# Altium project BRZ_LightLink.PrjPcb
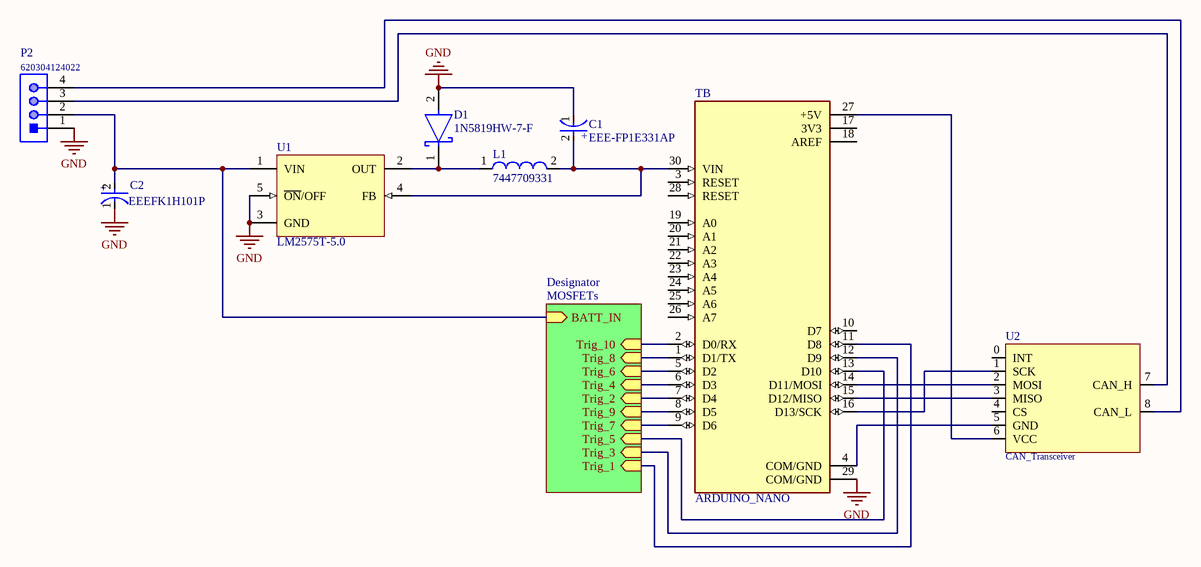
[diagram p0: LightLink.SchDoc]
2 sheets, 29 parts. Net scope: hierarchical (ports join the sheet entries above them; power ports are global).
Board file: LightLink.PcbDoc
Sheets:
  LightLink.SchDoc
    Designator = MOSFETs.SchDoc

## Sheet LightLink.SchDoc
size A4; SheetNumber: 1; SheetTotal: 3

### Parts
C1  EEE-FP1E331AP  [FP-FPF-MFG]
C2  EEEFK1H101P  [FP-FKF-MFG]
D1  1N5819HW-7-F  [FP-SOD123-IPC_A]
L1  7447709331  [WE-PD-XXL]
P2  620304124022  [620304124022]
TB  ARDUINO_NANO  [SHIELD_ARDUINO_NANO]
U1  LM2575T-5.0  [KC0005A]
U2  CAN_Transceiver

### Sub-sheets
Designator = MOSFETs: Trig_1 (in), Trig_3 (in), Trig_5 (in), Trig_7 (in), Trig_9 (in), Trig_2 (in), Trig_4 (in), Trig_6 (in), Trig_8 (in), Trig_10 (in), BATT_IN (in)

### Nets
GND: C1.1(C) C2.1(C) D1.2(A) P2.1 TB.29(COM/GND) U1.3(GND) U1.5(~{ON}/OFF)
NetC1_2: C1.2(A) L1.2 TB.30(VIN) U1.4(FB)
NetC2_2: C2.2(A) P2.2 U1.1(VIN) ; sheet Designator/BATT_IN
NetD1_1: D1.1(C) L1.1 U1.2(OUT)
NetP2_3: P2.3 U2.7(CAN_H)
NetP2_4: P2.4 U2.8(CAN_L)
NetR1_1: TB.11(D8) ; sheet Designator/Trig_1
NetR2_1: TB.12(D9) ; sheet Designator/Trig_3
NetR3_2: TB.7(D4) ; sheet Designator/Trig_2
NetR4_1: TB.13(D10) ; sheet Designator/Trig_5
NetR5_2: TB.6(D3) ; sheet Designator/Trig_4
NetR6_1: TB.9(D6) ; sheet Designator/Trig_7
NetR7_2: TB.5(D2) ; sheet Designator/Trig_6
NetR8_1: TB.8(D5) ; sheet Designator/Trig_9
NetR9_2: TB.1(D1/TX) ; sheet Designator/Trig_8
NetR10_2: TB.2(D0/RX) ; sheet Designator/Trig_10
NetTB_4: TB.4(COM/GND) U2.5(GND)
NetTB_14: TB.14(D11/MOSI) U2.2(MOSI)
NetTB_15: TB.15(D12/MISO) U2.3(MISO)
NetTB_16: TB.16(D13/SCK) U2.1(SCK)
NetTB_27: TB.27(+5V) U2.6(VCC)

Not connected (* = marked no-connect by the designer): TB 3(RESET) 10(D7) 17(3V3) 18(AREF) 19(A0) 20(A1) 21(A2) 22(A3) 23(A4) 24(A5) 25(A6) 26(A7) 28(RESET); U2 0(INT) 4(CS)

### Notes on the sheet
- (in symbol CMP-2000-06208-3) +
- (in symbol CMP-05427-000082-1) +

### Library data of the parts
C1 = CMP-05427-000082-1: CAP ALUM 330UF 20% 25V SMD; Dielectric Material: Aluminium; Ripple Current (AC): 850mA; Life (Hours): 2000Hour; ESR (Equivalent Series Resistance): 80mR; Leakage Current: 82.5uA; Package Quantity: 500; Height - Seated (Max): 0.402inch; Capacitance: 330uF; Max Operating Temperature: 105°C; Diameter: 8mm; Width: 8.3mm; Packaging: Tape and Reel; Radiation Hardening: No; Lead Pitch: 3.1mm; REACH SVHC: No SVHC; Contact Plating: Tin; Series: FP; Termination: SMD/SMT; RoHS Compliant: Yes; Material: Aluminium; Voltage Rating (DC): 25V; Voltage Rating: 25V; Min Operating Temperature: -55°C; Construction: Cylindrical; Length: 10.5mm; Number of Pins: 2; Case/Package: Radial; Voltage: 25V; Height: 10.2mm; Mount: Surface Mount; Tolerance: 20%; Lead Free: Lead Free; Ripple Current: 850mA
C2 = CMP-2000-06208-3: CAP ALUM 100UF 20% 50V SMD; Leakage Current: 3uA; ESR (Equivalent Series Resistance): 340mR; Material: Aluminium; Ripple Current: 350mA; Life (Hours): 2000Hour; Min Operating Temperature: -55°C; Contact Plating: Tin; REACH SVHC: No SVHC; RoHS Compliant: Yes; Width: 10mm; Radiation Hardening: No; Termination: SMD/SMT; Packaging: Tape and Reel; Max Operating Temperature: 105°C; Case/Package: Radial; Voltage Rating: 50V; Length: 10.2mm; Voltage: 50V; Package Quantity: 1; Voltage Rating (DC): 50V; Height - Seated (Max): 0.402inch; Mount: Surface Mount; Impedance: 340mR; Construction: Cylindrical; Height: 10.2mm; Lead Free: Lead Free; Dielectric Material: Aluminium; Series: FK; Tolerance: 20%; Diameter: 8mm; Ripple Current (AC): 350mA; Capacitance: 100uF; Number of Pins: 2
D1 = CMP-0303-00003-3: DIODE SCHOTTKY 40V 1A SOD123; Forward Voltage: 450mV; Capacitance: 110pF; Max Forward Surge Current (Ifsm): 25A; Peak Reverse Current: 50uA; Polarity: Standard; Element Configuration: Single; Max Power Dissipation: 450mW; Min Operating Temperature: -65°C; Package Quantity: 3000; Contact Plating: Tin; Weight: 0.000353oz; Max Repetitive Reverse Voltage (Vrrm): 40V; Max Reverse Voltage (DC): 40V; Height: 1.25mm; Average Rectified Current: 1A; Width: 1.7mm; Case/Package: SOD-123-2; Lead Free: Lead Free; Max Operating Temperature: 125°C; Current Rating: 1A; Termination: SMD/SMT; Forward Current: 1A; Radiation Hardening: No; Number of Pins: 2; Length: 2.85mm; Voltage Rating (DC): 40V; REACH SVHC: No SVHC; Peak Non-Repetitive Surge Current: 25A; Packaging: Tape and Reel; Output Current: 1A
L1 = CMP-0227-00183-1: SMD-Shielded Power Inductor WE-PD, L = 330 µH; Inductance: 330 ÂµH; PackageReference: WE-PD-XXL; PackageDescription: SMD Inductor, 2-Leads, Body 12.0 x 12.0 mm; ComponentLink1Description: Manufacturer Link; ComponentLink2Description: Datasheet; PackageVersion: 2004; ComponentLink1URL: http://www.we-online.com; DatasheetVersion: ver 1, Oct-2004; ComponentLink2URL: http://www.we-online.de/katalog/media/pdf/7447709331.pdf
P2 = CMP-1502-00662-1: Male Shrouded Header WR-WTB, SMT, Vertical, pitch 2 mm, 1 x 4 position; Manufacturer: Wurth Elektronik; Working Voltage: 100VAC; Contact Resistance: 20mOhm; Pitch: 2mm; Position: 1x4; Part Number: 620304124022; Orientation: Vertical; Publisher: WurthElektronik; Packaging: TapeandReel; Gender: Male; Mounting Technology: SMT; Operating Temperature: -25to85degC; Manufacturer URL: http://www.we-online.de; Package Reference: 620304124022; Datasheet URL: https://katalog.we-online.de/em/datasheet/6203xx124022.pdf
TB = CMP-002-000000-1: ATSAMD21G18A Arduino Nano 33 IoT SAM D ARMÂ® CortexÂ®-M0+ MCU 32-Bit Embedded Evaluation Board; MF: Arduino; Package: None; Value: *; Availability: Unavailable; Pin Count: 30; Design Item ID: ARDUINO_NANO; MP: ARDUINO NANO; Price: None; Component Type: Standard; Source: SnapEDAsch.SchLib; SnapEDA_Link: https://www.snapeda.com/parts/ARDUINO%20NANO/Arduino/view-part/1128261/?ref=snap
U1 = CMP-0069-02026-3: SIMPLE SWITCHER® 1A Step-Down Voltage Regulator, 5-pin TO-220; Manufacturer: Texas Instruments; PackageTopMarking: NSUZXYTTE#*LM2575T*-5.0 P+; PowerWise: N; RoHS: N; Code_JEDEC: TO-220-AB; ComponentLink1Description: Datasheet URL; CompType: Switcher; PackageReference: KC0005A; PinCount: 5; PackageDescription: TO-220, Molded, 5 Lead, Straight; ComponentLink1URL: http://www.ti.com/general/docs/lit/getliterature.tsp?genericPartNumber=LM2575-N&fileType=pdf
U2 = CAN_Transceiver: Footprint for existing SPI transceiver

## Sheet MOSFETs.SchDoc
size A4; SheetNumber: 2; SheetTotal: 3
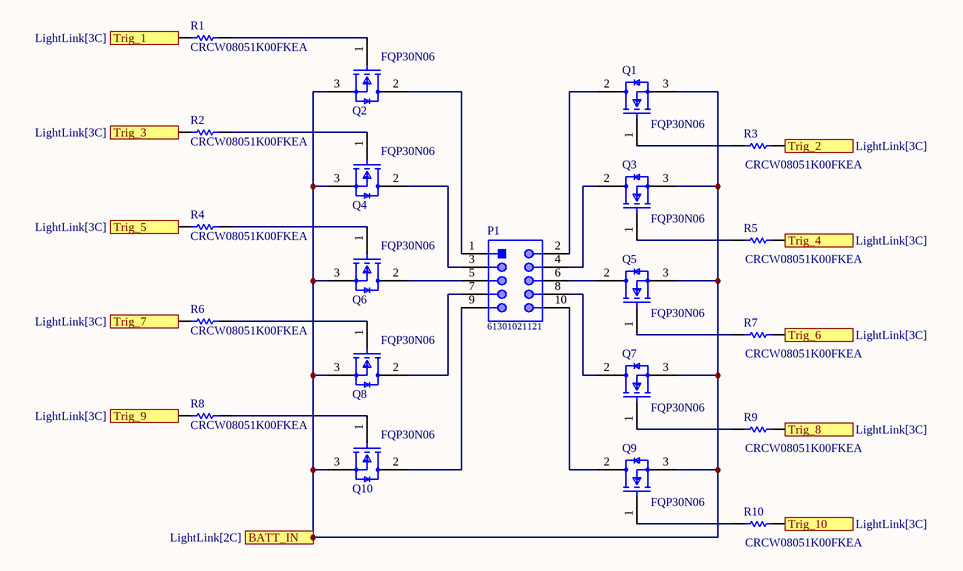
[diagram p1: MOSFETs.SchDoc]

### Parts
P1  61301021121  [61301021121]
Q1  FQP30N06  [FP-340AT-MFG]
Q2  FQP30N06  [FP-340AT-MFG]
Q3  FQP30N06  [FP-340AT-MFG]
Q4  FQP30N06  [FP-340AT-MFG]
Q5  FQP30N06  [FP-340AT-MFG]
Q6  FQP30N06  [FP-340AT-MFG]
Q7  FQP30N06  [FP-340AT-MFG]
Q8  FQP30N06  [FP-340AT-MFG]
Q9  FQP30N06  [FP-340AT-MFG]
Q10  FQP30N06  [FP-340AT-MFG]
R1  CRCW08051K00FKEA  [RESC2013X50X30NL20T20]
R2  CRCW08051K00FKEA  [RESC2013X50X30NL20T20]
R3  CRCW08051K00FKEA  [RESC2013X50X30NL20T20]
R4  CRCW08051K00FKEA  [RESC2013X50X30NL20T20]
R5  CRCW08051K00FKEA  [RESC2013X50X30NL20T20]
R6  CRCW08051K00FKEA  [RESC2013X50X30NL20T20]
R7  CRCW08051K00FKEA  [RESC2013X50X30NL20T20]
R8  CRCW08051K00FKEA  [RESC2013X50X30NL20T20]
R9  CRCW08051K00FKEA  [RESC2013X50X30NL20T20]
R10  CRCW08051K00FKEA  [RESC2013X50X30NL20T20]

### Ports
BATT_IN (in, see LightLink[2C]), Trig_1 (in, see LightLink[3C]), Trig_2 (in, see LightLink[3C]), Trig_3 (in, see LightLink[3C]), Trig_4 (in, see LightLink[3C]), Trig_5 (in, see LightLink[3C]), Trig_6 (in, see LightLink[3C]), Trig_7 (in, see LightLink[3C]), Trig_8 (in, see LightLink[3C]), Trig_9 (in, see LightLink[3C]), Trig_10 (in, see LightLink[3C])

### Nets
NetC2_2: Q1.3(S) Q2.3(S) Q3.3(S) Q4.3(S) Q5.3(S) Q6.3(S) Q7.3(S) Q8.3(S) Q9.3(S) Q10.3(S) ; port BATT_IN
NetP1_1: P1.1 Q2.2(D)
NetP1_2: P1.2 Q1.2(D)
NetP1_3: P1.3 Q4.2(D)
NetP1_4: P1.4 Q3.2(D)
NetP1_5: P1.5 Q6.2(D)
NetP1_6: P1.6 Q5.2(D)
NetP1_7: P1.7 Q8.2(D)
NetP1_8: P1.8 Q7.2(D)
NetP1_9: P1.9 Q10.2(D)
NetP1_10: P1.10 Q9.2(D)
NetQ1_1: Q1.1(G) R3.1
NetQ2_1: Q2.1(G) R1.2
NetQ3_1: Q3.1(G) R5.1
NetQ4_1: Q4.1(G) R2.2
NetQ5_1: Q5.1(G) R7.1
NetQ6_1: Q6.1(G) R4.2
NetQ7_1: Q7.1(G) R9.1
NetQ8_1: Q8.1(G) R6.2
NetQ9_1: Q9.1(G) R10.1
NetQ10_1: Q10.1(G) R8.2
NetR1_1: R1.1 ; port Trig_1
NetR2_1: R2.1 ; port Trig_3
NetR3_2: R3.2 ; port Trig_2
NetR4_1: R4.1 ; port Trig_5
NetR5_2: R5.2 ; port Trig_4
NetR6_1: R6.1 ; port Trig_7
NetR7_2: R7.2 ; port Trig_6
NetR8_1: R8.1 ; port Trig_9
NetR9_2: R9.2 ; port Trig_8
NetR10_2: R10.2 ; port Trig_10

### Library data of the parts
P1 = CMP-1502-01084-1: THT Vertical Pin Header WR-PHD, Pitch 2.54 mm, Dual Row, 10 pins; Manufacturer: Wurth Elektronik; Working Voltage: 250VAC; Pitch: 2.54mm; Contact Resistance: 20mOhm; Gender: Male; Rated Current: 3A; Withstanding Voltage: 500VAC; Pin Number: 10; Operating Temperature: -40to105degC; Mounting Technology: THT; Publisher: WurthElektronik; Manufacturer URL: http://www.we-online.de; Part Number: 61301021121; Row Number: Dual; Packaging: Bag; Orientation: Vertical; Package Reference: 61301021121; Datasheet URL: https://katalog.we-online.de/em/datasheet/6130xx21121.pdf
Q1-Q10 = CMP-07173-000001-1: MOSFET N-CH 60V 30A TO-220; Manufacturer: ON Semiconductor; Threshold Vgs Min: 2V; Power Dissipation: 79W; Rthja Max: 62.5°C/W; Gate To Source Voltage: 25V; Pulse Drain Current: 120A; Transconductance: 16S; Gate Charge At Vgs: 19nC @ 10V; Number Of Channels: 1; Standoff Height: 2.7mm; Input Capacitace At Vds: 725pF @ 25V; Max Junction Temp: +175°C; Depletion Mode: False; Reverse Recovery Charge: 65nC; Threshold Vgs Max: 4V; Max Forward Diode Voltage: 1.5V; Turn On Delay Time: 10ns; Reverse Recovery Time: 45ns; Drain To Source Resistance: 0.031Ω; Turn Off Delay Time: 35ns; Continuous Drain Current: 30A; Manufacturer Part Number: FQP30N06; Octopart: https://octopart.com/fqp30n06-on+semiconductor-84328004; Temperature: -55°C to +175°C; Ipc Land Pattern Name: TO-220; Digikey Description: MOSFET N-CH 60V 30A TO-220; Height: 20.4mm; RoHS: TRUE; Mouser Description: MOSFET 60V N-Channel QFET; Device Class L2: Transistors; Automotive: No; Footprint Url: https://www.onsemi.com/pub/Collateral/340AT.PDF; Number Of N Channels: 1; Device Class L1: Discrete Semiconductors; Package: 340AT; Temperature Range High: +175°C; Temperature Range Low: -55°C; ComponentLink2URL: https://www.onsemi.com/pub/Collateral/FQP30N06-D.pdf; Drain To Source Breakdown Voltage: 60V; Category: Trans; ComponentLink2Description: Datasheet; Device Class L3: MOSFETs; Drain To Source Voltage: 60V; Lead Free: Yes
R1-R10 = CMP-1013-00510-2: Manufacturer: Vishay Dale; Part Number: CRCW08051K00FKEA

## Nets that join several sheets
NetC2_2: LightLink (C2.2 P2.2 U1.1), MOSFETs (10 pins)
NetR1_1: LightLink (TB.11), MOSFETs (R1.1)
NetR2_1: LightLink (TB.12), MOSFETs (R2.1)
NetR3_2: LightLink (TB.7), MOSFETs (R3.2)
NetR4_1: LightLink (TB.13), MOSFETs (R4.1)
NetR5_2: LightLink (TB.6), MOSFETs (R5.2)
NetR6_1: LightLink (TB.9), MOSFETs (R6.1)
NetR7_2: LightLink (TB.5), MOSFETs (R7.2)
NetR8_1: LightLink (TB.8), MOSFETs (R8.1)
NetR9_2: LightLink (TB.1), MOSFETs (R9.2)
NetR10_2: LightLink (TB.2), MOSFETs (R10.2)